# Altium schematic sheet [01] - POWER.SchDoc
size A4; DocumentNumber: 1; SheetNumber: 1; SheetTotal: 14
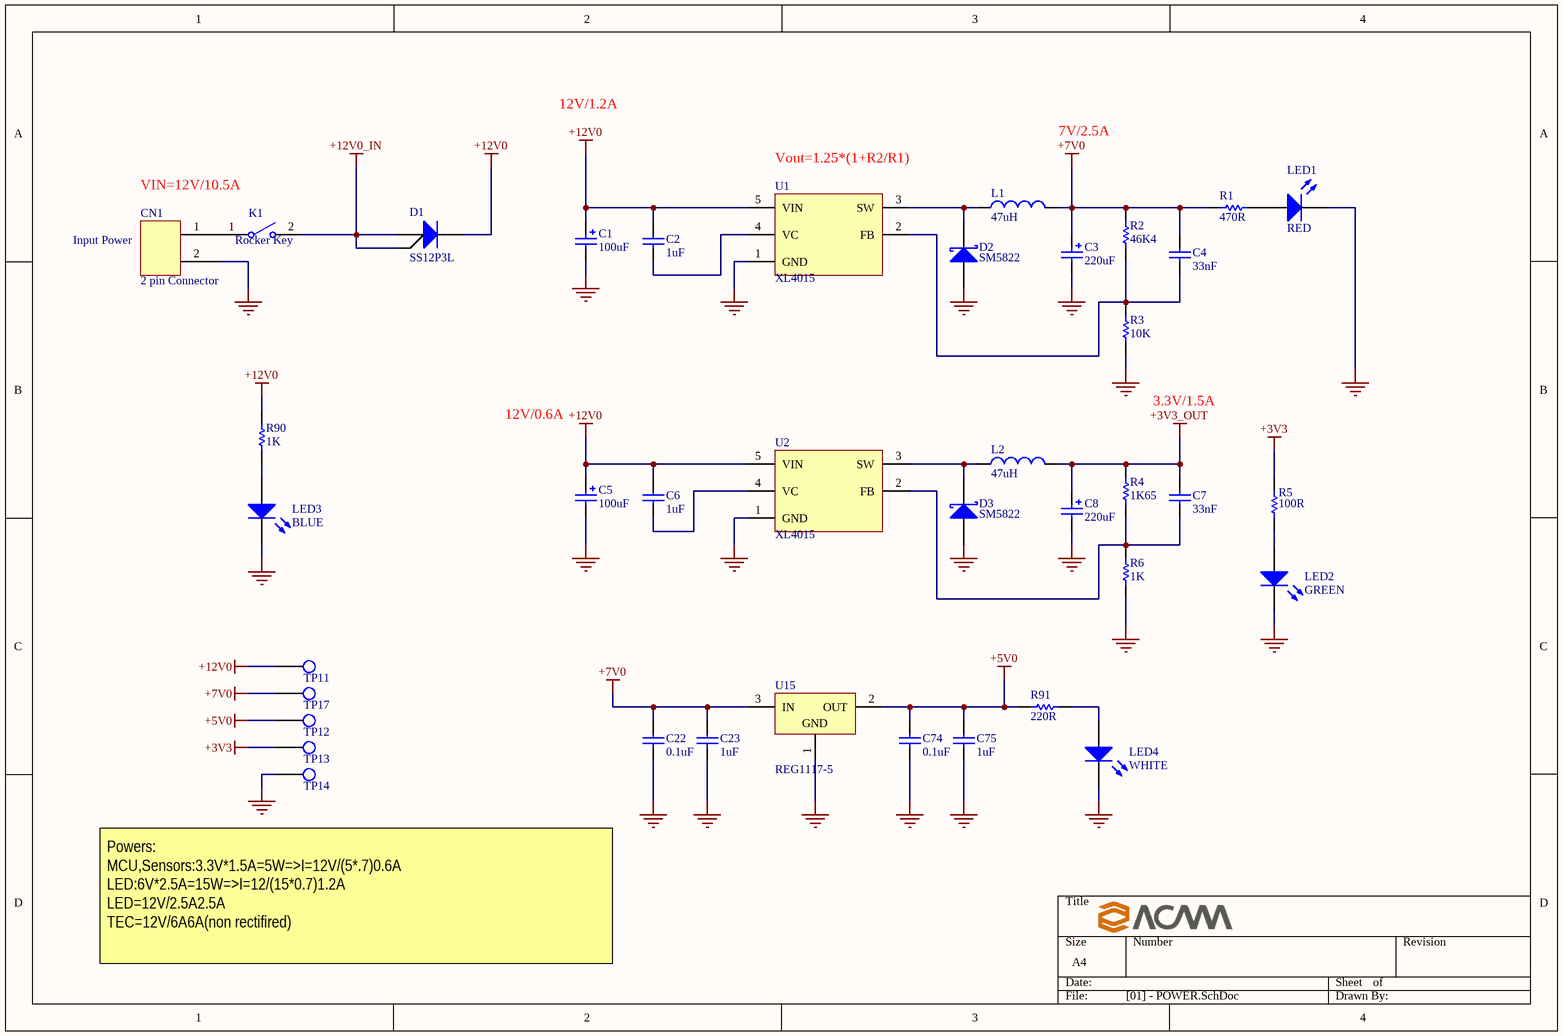
[diagram p0: [01] - POWER.SchDoc]

## Parts
C1  100uF  [WCAP-ASLI_6.3x5.5]
C2  1uF  [0805_C_AUTO]
C3  220uF  [WCAP-ASLI_6.3x5.5]
C4  33nF  [0805_C_AUTO]
C5  100uF  [WCAP-ASLI_6.3x5.5]
C6  1uF  [0805_C_AUTO]
C7  33nF  [0805_C_AUTO]
C8  220uF  [WCAP-ASLI_6.3x5.5]
C22  0.1uF  [0805_C_AUTO]
C23  1uF  [0805_C_AUTO]
C74  0.1uF  [0805_C_AUTO]
C75  1uF  [0805_C_AUTO]
CN1  2 pin Connector  [KF142R_CONN_2PIN]
D1  SS12P3L  [TO-277A]
D2  SM5822  [DO-214AB]
D3  SM5822  [DO-214AB]
K1  Rocker Key  [MR-1-116]
L1  47uH  [INDUCTOR_12x12]
L2  47uH  [INDUCTOR_12x12]
LED1  RED  [LED_1206]
LED2  GREEN  [LED_1206]
LED3  BLUE  [LED_1206]
LED4  WHITE  [LED_1206]
R1  470R  [0805_R_AUTO]
R2  46K4  [0805_R_AUTO]
R3  10K  [0805_R_AUTO]
R4  1K65  [0805_R_AUTO]
R5  100R  [0805_R_AUTO]
R6  1K  [0805_R_AUTO]
R90  1K  [0805_R_AUTO]
R91  220R  [0805_R_AUTO]
TP11  Test Point  [PIN_2mm]  (value not drawn)
TP12  Test Point  [PIN_2mm]  (value not drawn)
TP13  Test Point  [PIN_2mm]  (value not drawn)
TP14  Test Point  [PIN_2mm]  (value not drawn)
TP17  Test Point  [PIN_2mm]  (value not drawn)
U1  XL4015  [TO-263-5]
U2  XL4015  [TO-263-5]
U15  REG1117-5  [SOT-223]

## Nets
+3V3: R5.1 TP13.1
+3V3_OUT: C7.2 C8.1 L2.2 R4.2
+5V0: C74.2 C75.2 R91.1 TP12.1 U15.2(OUT)
+7V0: C3.1 C4.2 C22.2 C23.2 L1.2 R1.2 R2.2 TP17.1 U15.3(IN)
+12V0: C1.1 C2.2 C5.1 C6.2 D1.3(K) R90.2 TP11.1 U1.5(VIN) U2.5(VIN)
+12V0_IN: D1.1(A1) D1.2(A2) K1.2(NO)
GND: C1.2 C3.2 C5.2 C8.2 C22.1 C23.1 C74.1 C75.1 CN1.2 D2.1(A) D3.1(A) LED1.2(K) LED2.2(K) LED3.2(K) LED4.2(K) R3.1 R6.1 TP14.1 U1.1(GND) U2.1(GND) U15.1(GND)
NetC2_1: C2.1 U1.4(VC)
NetC4_1: C4.1 R2.1 R3.2 U1.2(FB)
NetC6_1: C6.1 U2.4(VC)
NetC7_1: C7.1 R4.1 R6.2 U2.2(FB)
NetCN1_1: CN1.1 K1.1(COMMON)
NetD2_2: D2.2(K) L1.1 U1.3(SW)
NetD3_2: D3.2(K) L2.1 U2.3(SW)
NetLED1_1: LED1.1(A) R1.1
NetLED2_1: LED2.1(A) R5.2
NetLED3_1: LED3.1(A) R90.1
NetLED4_1: LED4.1(A) R91.2

## Notes on the sheet
- 12V/1.2A
- (near U1) Vout=1.25*(1+R2/R1)
- 7V/2.5A
- (near CN1) Input Power
- VIN=12V/10.5A
- 12V/0.6A
- 3.3V/1.5A
- Powers:
  MCU,Sensors:3.3V*1.5A=5W=>I=12V/(5*.7)0.6A
  LED:6V*2.5A=15W=>I=12/(15*0.7)1.2A
  LED=12V/2.5A2.5A
  TEC=12V/6A6A(non rectifired)

## Library data of the parts
C1 C5 = Cap Aluminium Electrolytic: Aluminium Electrolytic Capacitor; RATED_VOLTAGE: 25V; Value: 100uF; Manufacturer Part Num: *
C2 C6 C23 C75 = Cap SMD: Non-Pol SMD Capacitor; RATED_VOLTAGE: 25V; Value: 1uF; Manufacturer Part Num: *
C3 C8 = Cap Aluminium Electrolytic: Aluminium Electrolytic Capacitor; RATED_VOLTAGE: 16V; Value: 220uF; Manufacturer Part Num: *
C4 C7 C22 C74 = Cap SMD: Non-Pol SMD Capacitor; RATED_VOLTAGE: 16V; Manufacturer Part Num: *
  C4 C7: Value: 33nF
  C22 C74: Value: 0.1uF; Dielectric: *
CN1 = Connector Screwless 2 pin: KAIFENG Screwless Connector 2 pin; Manufacturer Part Num: KF142R; Value: 2 pin Connector
D1 = Diode dual: High Current Density Surface Mount Schottky Barrier Rectifiers; Manufacturer Part Num: SS12P3LHM3_A/H; Value: SS12P3L
D2 D3 = Diode Schottky: Schottky Diode; Value: SM5822
K1 = Rocker Key: Manufacturer Part Num: MR-1-116-C5N-BB; Value: Rocker Key
L1 L2 = Inductor: Inductor SMD; Manufacturer Part Num: MSS1210-473MED; Value: 47uH
LED1-LED4 = LED: Typical LED
  LED1: Value: RED
  LED2: Value: GREEN
  LED3: Value: BLUE
  LED4: Value: WHITE
R1-R4 R6 = Res SMD: SMD Resistor; Tolerance: 1%; Manufacturer Part Num: *
  R1: Value: 470R
  R2: Value: 46K4
  R3: Value: 10K
  R4: Value: 1K65
  R6: Value: 1K
R5 R90 R91 = Res SMD: SMD Resistor; Tolerance: 5%; Manufacturer Part Num: *
  R5: Value: 100R
  R90: Value: 1K
  R91: Value: 220R
TP11-TP14 TP17 = Test Point: Test Point Footprint; Value: Test Point
U15 = REG1117: 3-Terminal Positive Fixed Voltage Regulator; Value: REG1117-5
U1 U2 = XL4015: Value: XL4015